# Altium schematic sheet DS18B20.SchDoc
size A
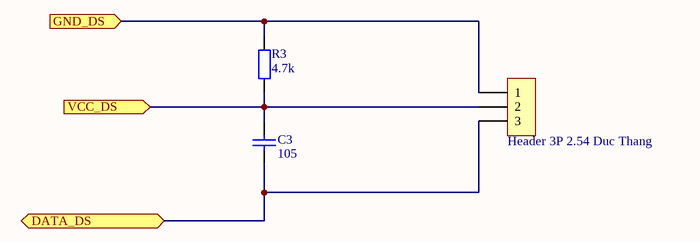
[diagram p0: DS18B20.SchDoc]

## Parts
C3  105  [tu 0805]
DS18  Header 3P 2.54 Duc Thang  [XH2.54M-3]
R3  4.7k  [tro smd 0805]

## Ports
DATA_DS (bidir), GND_DS (in), VCC_DS (in)

## Nets
DATA_DS: C3.2 DS18.3 ; port DATA_DS
GND_DS: DS18.1 R3.2 ; port GND_DS
VCC_DS: C3.1 DS18.2 R3.1 ; port VCC_DS

## Library data of the parts
C3 = Tu 0805 105 50V 10%: Dán; Don_Vi: Con; So_Chan: 2; Ten_Linh_Kien: Tụ 0805 105-1uF 10% 50V; Ma_Hang: MH004552; Chung_Loai: Dán; Kieu_Chan: *
DS18 = Header 3P 2.54 Duc Thang: Cắm; Ten_Linh_Kien: Header 3P XH2.54-3P Đực Thẳng; Don_Vi: Con; Ma_Hang: MH001292; Chung_Loai: Cắm
R3 = Tro 0805 5% 4.7k: Dán; Don_Vi: Con; So_Chan: 2; Ten_Linh_Kien: Trở 0805 5% 4.7k; Ma_Hang: MH005307; Chung_Loai: Dán; Kieu_Chan: *